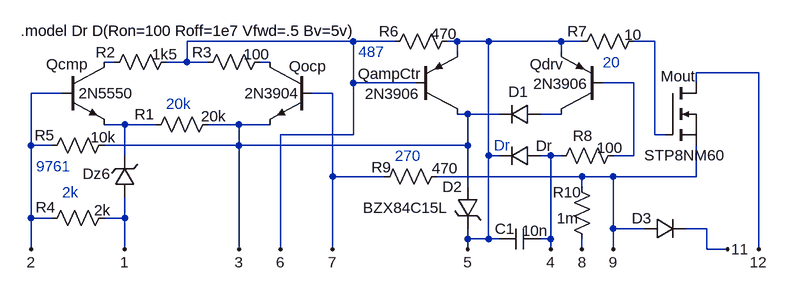
[diagram p0: schematic Stk730_090.asc]
Stk730_090.asc, the LTspice schematic file:
Version 4
SHEET 1 1268 680
WIRE 560 64 304 64
WIRE 624 64 560 64
WIRE 720 64 704 64
WIRE 768 64 720 64
WIRE 880 64 768 64
WIRE 912 64 880 64
WIRE 1024 64 992 64
WIRE 720 80 720 64
WIRE 880 80 880 64
WIRE 192 96 176 96
WIRE 304 96 304 64
WIRE 304 96 272 96
WIRE 336 96 304 96
WIRE 432 96 416 96
WIRE 1184 112 1088 112
WIRE 560 128 560 64
WIRE 656 128 560 128
WIRE 992 128 944 128
WIRE 1088 128 1088 112
WIRE 112 144 64 144
WIRE 528 144 496 144
WIRE 736 176 720 176
WIRE 784 176 736 176
WIRE 880 176 848 176
WIRE 208 192 176 192
WIRE 256 192 208 192
WIRE 384 192 336 192
WIRE 432 192 384 192
WIRE 560 208 560 128
WIRE 560 208 448 208
WIRE 1024 208 1024 64
WIRE 1040 208 1024 208
WIRE 64 224 64 144
WIRE 96 224 64 224
WIRE 384 224 384 192
WIRE 384 224 176 224
WIRE 736 224 736 176
WIRE 736 224 384 224
WIRE 208 240 208 192
WIRE 768 240 768 64
WIRE 784 240 768 240
WIRE 864 240 848 240
WIRE 880 240 864 240
WIRE 992 240 992 128
WIRE 992 240 960 240
WIRE 528 272 528 144
WIRE 608 272 528 272
WIRE 912 272 688 272
WIRE 960 272 912 272
WIRE 1088 272 1088 224
WIRE 1088 272 960 272
WIRE 736 288 736 224
WIRE 912 288 912 272
WIRE 64 336 64 224
WIRE 96 336 64 336
WIRE 208 336 208 304
WIRE 208 336 176 336
WIRE 960 352 960 272
WIRE 1008 352 960 352
WIRE 1104 352 1072 352
WIRE 736 368 736 352
WIRE 768 368 768 240
WIRE 768 368 736 368
WIRE 784 368 768 368
WIRE 864 368 864 240
WIRE 864 368 848 368
WIRE 64 384 64 336
WIRE 208 384 208 336
WIRE 384 384 384 224
WIRE 448 384 448 208
WIRE 528 384 528 272
WIRE 736 384 736 368
WIRE 864 384 864 368
WIRE 912 384 912 368
WIRE 960 384 960 352
WIRE 1104 384 1104 352
WIRE 1136 384 1104 384
WIRE 1184 384 1184 112
FLAG 64 384 2
FLAG 208 384 1
FLAG 384 384 3
FLAG 528 384 7
FLAG 448 384 6
FLAG 736 384 5
FLAG 864 384 4
FLAG 1184 384 12
FLAG 912 384 8
FLAG 960 384 9
FLAG 1136 384 11
SYMBOL npn2 112 96 R0
WINDOW 0 -25 3 Left 0
WINDOW 3 25 48 Left 0
SYMATTR InstName Qcmp
SYMATTR Value 2N5550
SYMBOL npn2 496 96 M0
WINDOW 0 -23 6 Left 0
WINDOW 3 19 48 Left 0
SYMATTR InstName Qocp
SYMATTR Value 2N3904
SYMBOL res 352 176 R90
WINDOW 0 16 113 VBottom 0
WINDOW 3 -12 7 VTop 0
SYMATTR InstName R1
SYMATTR Value 20k
SYMBOL res 288 80 R90
WINDOW 0 16 109 VBottom 0
WINDOW 3 -12 18 VTop 0
SYMATTR InstName R2
SYMATTR Value 1k5
SYMBOL res 432 80 R90
WINDOW 0 16 105 VBottom 0
WINDOW 3 -12 21 VTop 0
SYMATTR InstName R3
SYMATTR Value 100
SYMBOL zener 224 304 R180
WINDOW 0 38 36 Left 0
WINDOW 3 24 0 Invisible 0
SYMATTR InstName Dz6
SYMATTR Value BZX84C6V2L
SYMBOL res 192 320 R90
WINDOW 0 15 106 VBottom 0
WINDOW 3 -12 18 VTop 0
SYMATTR InstName R4
SYMATTR Value 2k
SYMBOL res 192 208 R90
WINDOW 0 16 107 VBottom 0
WINDOW 3 -12 17 VTop 0
SYMATTR InstName R5
SYMATTR Value 10k
SYMBOL pnp2 944 176 R180
WINDOW 0 60 77 Left 0
WINDOW 3 22 47 Left 0
SYMATTR InstName Qdrv
SYMATTR Value 2N3906
SYMBOL pnp2 656 176 M180
WINDOW 0 -89 62 Left 0
WINDOW 3 -78 31 Left 0
SYMATTR InstName QampCtr
SYMATTR Value 2N3906
SYMBOL res 720 48 R90
WINDOW 0 16 105 VBottom 0
WINDOW 3 -11 20 VTop 0
SYMATTR InstName R6
SYMATTR Value 470
SYMBOL res 1008 48 R90
WINDOW 0 16 103 VBottom 0
WINDOW 3 -10 17 VTop 0
SYMATTR InstName R7
SYMATTR Value 10
SYMBOL diode 848 160 R90
WINDOW 0 -3 34 VBottom 0
WINDOW 3 -10 0 Invisible 0
SYMATTR InstName D1
SYMATTR Value 1N914
SYMBOL res 976 224 R90
WINDOW 0 1 63 VBottom 0
WINDOW 3 -12 21 VTop 0
SYMATTR InstName R8
SYMATTR Value 100
SYMBOL cap 848 352 R90
WINDOW 0 16 55 VBottom 0
WINDOW 3 -12 8 VTop 0
SYMATTR InstName C1
SYMATTR Value 10n
SYMBOL res 704 256 R90
WINDOW 0 17 101 VBottom 0
WINDOW 3 -12 3 VTop 0
SYMATTR InstName R9
SYMATTR Value 470
SYMBOL nmos 1040 128 R0
WINDOW 0 -7 -10 Left 0
WINDOW 3 -32 111 Left 0
SYMATTR InstName Mout
SYMATTR Value STP8NM60
SYMBOL diode 1008 368 R270
WINDOW 0 16 -4 VTop 0
WINDOW 3 0 32 Invisible 0
SYMATTR InstName D3
SYMATTR Value BYW96E
SYMBOL zener 752 288 M0
WINDOW 3 46 32 Left 0
SYMATTR Value BZX84C15L
SYMATTR InstName D2
SYMBOL diode 848 256 M270
WINDOW 0 16 -6 VTop 0
WINDOW 3 -25 37 Invisible 0
SYMATTR InstName Dr
SYMATTR Value 1N914
SYMATTR Description Zener Diode
SYMATTR Type zener
SYMBOL res 896 272 R0
WINDOW 0 -29 24 Left 0
WINDOW 3 -23 64 Left 0
SYMATTR InstName R10
SYMATTR Value 1m
TEXT 48 48 Left 0 !.model Dr D(Ron=100 Roff=1e7 Vfwd=.5 Bv=5v)
TEXT 776 224 Left 0 ;Dr
TEXT 272 160 Left 0 ;20k
TEXT 72 256 Left 0 ;9761
TEXT 568 80 Left 0 ;487
TEXT 112 296 Left 0 ;2k
TEXT 944 96 Left 0 ;20
TEXT 624 240 Left 0 ;270

The netlist it stands for:
* Stk730_090.asc
Qcmp N002 2 N006 0 2N5550
Qocp N003 7 3 0 2N3904
R1 3 N006 20k
R2 6 N002 1k5
R3 N003 6 100
Dz6 1 N006 BZX84C6V2L
R4 1 2 2k
R5 3 2 10k
Qdrv N005 N004 5 0 2N3906
QampCtr 3 6 5 0 2N3906
R6 5 6 470
R7 N001 5 10
D1 N005 3 1N914
R8 N004 4 100
C1 4 5 10n
R9 9 7 470
Mout 12 N001 9 9 STP8NM60
D3 9 11 BYW96E
D2 3 5 BZX84C15L
Dr 4 5 1N914
R10 9 8 1m
.model D D
.lib standard.dio
.model NPN NPN
.model PNP PNP
.lib standard.bjt
.model NMOS NMOS
.model PMOS PMOS
.lib standard.mos
.model Dr D(Ron=100 Roff=1e7 Vfwd=.5 Bv=5v)
* Dr
* 20k
* 9761
* 487
* 2k
* 20
* 270
.backanno
.end